# Altium project ebc_aux_power.PrjPcb
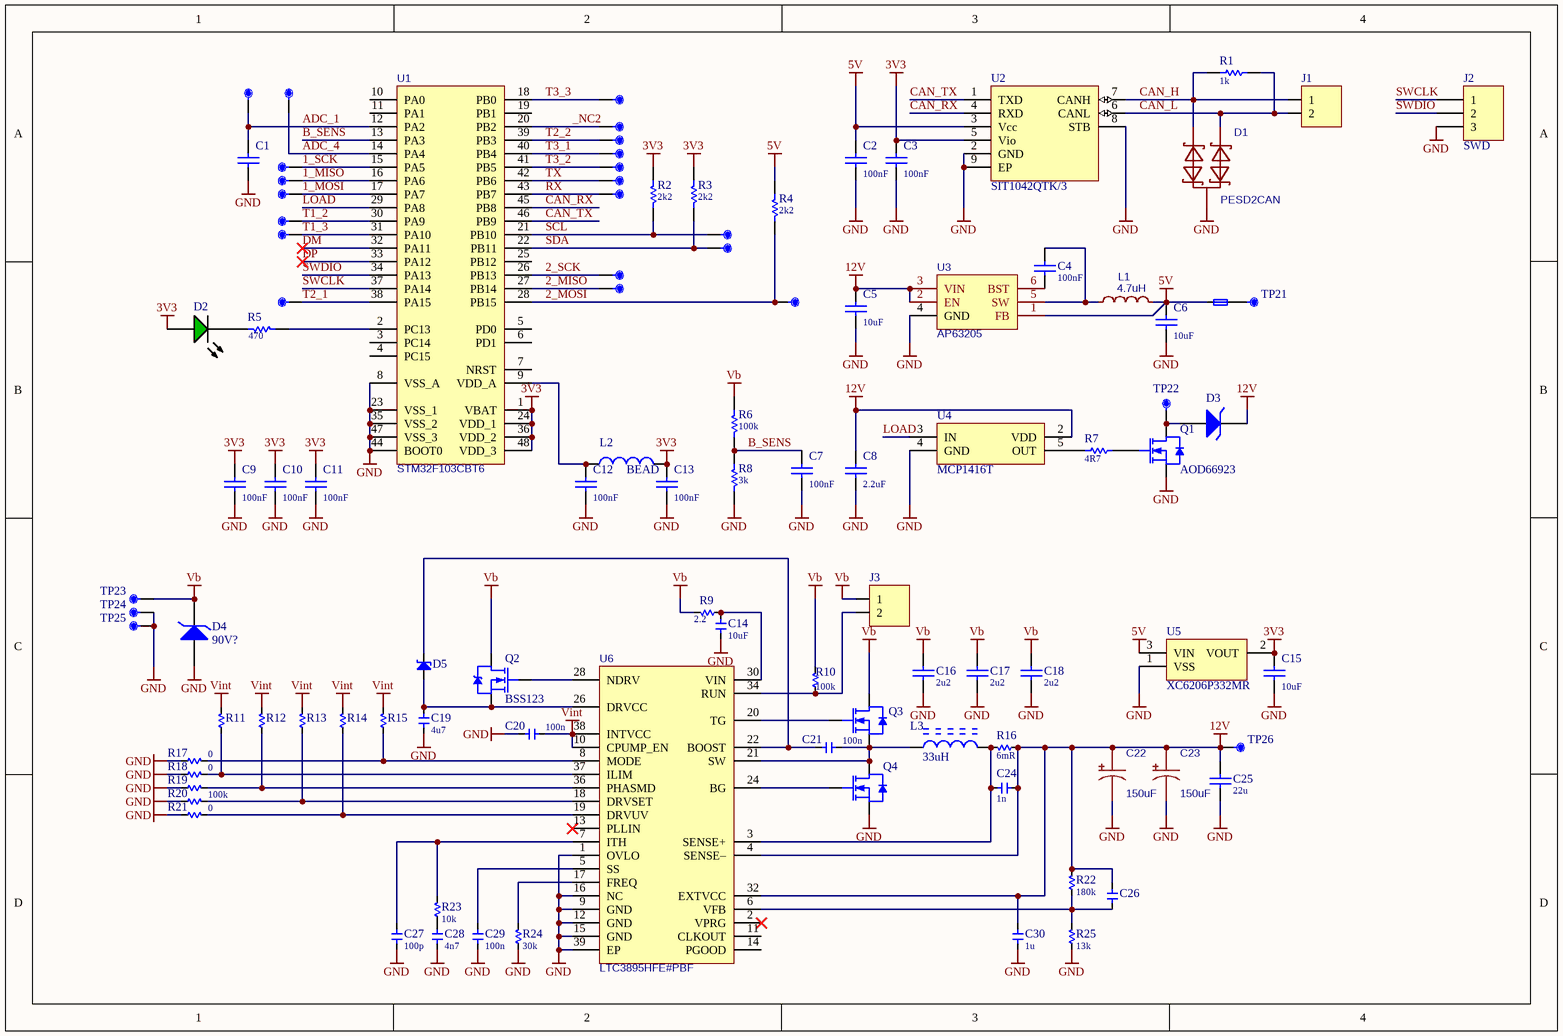
[diagram p0: schematic.SchDoc]
PRJ_ID: EBC Aux Power; PRJ_VER: 1.0.0
1 sheet, 103 parts. Net scope: global (net labels, ports and power ports of the same name join across sheets).
Board file: board.PcbDoc

## Sheet schematic.SchDoc
size A4

### Parts
C1  100nF  [C0402]  (value not drawn)
C2  100nF  [C0402]
C3  100nF  [C0402]
C4  100nF  [C0402]
C5  10uF  [C1206]
C6  10uF  [C1206]
C7  100nF  [C0402]
C8  2.2uF  [C0603]
C9  100nF  [C0402]
C10  100nF  [C0402]
C11  100nF  [C0402]
C12  100nF  [C0402]
C13  100nF  [C0402]
C14  10uF  [C0805]
C15  10uF  [C0603]
C16  2u2  [C1210]
C17  2u2  [C1210]
C18  2u2  [C1210]
C19  4u7  [C0805]
C20  100n  [C0603]
C21  100n  [C0603]
C22  150uF  [C7343]
C23  150uF  [C7343]
C24  1n  [C0402]
C25  22u  [C1210]
C26  (no value)  [C0402]  (no BOM)
C27  100p  [C0402]
C28  4n7  [C0402]
C29  100n  [C0402]
C30  1u  [C0805]
D1  PESD2CAN  [SOT-23]
D2  GRN  [LED-0603-GRN]  (value not drawn)
D3  (no value)  [SMC]
D4  90V?  [SMC]
D5  1N4148WS  [SOD-323]  (value not drawn)
F1  0.25A  [FUSE-1206]  (value not drawn)
J1  (no value)  [HDR-1X2_2.54]  (no BOM)
J2  SWD  [HDR-1x3-P1.25]  (no BOM)
J3  (no value)  [HDR-1x2-P1.25]  (no BOM)
L1  4.7uH  [IND-SMD_L4.4-W4.2]
L2  BEAD  [L0402]
L3  33uH  [IND_10X11.5MM]
Q1  AOD66923  [TO-252AA (DPAK)]
Q2  BSS123  [SOT-23]
Q3  AOD66923  [TO-252AA (DPAK)]  (value not drawn)
Q4  AOD66923  [TO-252AA (DPAK)]  (value not drawn)
R1  1k  [R1206]
R2  2k2  [R0402]
R3  2k2  [R0402]
R4  2k2  [R0402]
R5  470  [R0402]
R6  100k  [R0603]
R7  4R7  [R0402]
R8  3k  [R0603]
R9  2.2  [R0603]
R10  100k  [R0603]
R11  (no value)  [R0603]  (no BOM)
R12  (no value)  [R0603]  (no BOM)
R13  (no value)  [R0603]  (no BOM)
R14  (no value)  [R0603]  (no BOM)
R15  (no value)  [R0603]  (no BOM)
R16  6mR  [R2512-WIDE]
R17  0  [R0603]
R18  0  [R0603]
R19  (no value)  [R0603]  (no BOM)
R20  100k  [R0603]
R21  0  [R0603]
R22  180k  [R0603]
R23  10k  [R0603]
R24  30k  [R0603]
R25  13k  [R0603]
TP1  (no value)  [TP_THT]  (no BOM)
TP2  (no value)  [TP_THT]  (no BOM)
TP3  (no value)  [TP_THT]  (no BOM)
TP4  (no value)  [TP_THT]  (no BOM)
TP5  (no value)  [TP_THT]  (no BOM)
TP6  (no value)  [TP_THT]  (no BOM)
TP7  (no value)  [TP_THT]  (no BOM)
TP8  (no value)  [TP_THT]  (no BOM)
TP9  (no value)  [TP_THT]  (no BOM)
TP10  (no value)  [TP_THT]  (no BOM)
TP11  (no value)  [TP_THT]  (no BOM)
TP12  (no value)  [TP_THT]  (no BOM)
TP13  (no value)  [TP_THT]  (no BOM)
TP14  (no value)  [TP_THT]  (no BOM)
TP15  (no value)  [TP_THT]  (no BOM)
TP16  (no value)  [TP_THT]  (no BOM)
TP17  (no value)  [TP_THT]  (no BOM)
TP18  (no value)  [TP_THT]  (no BOM)
TP19  (no value)  [TP_THT]  (no BOM)
TP20  (no value)  [TP_THT]  (no BOM)
TP21  (no value)  [TP_THT]  (no BOM)
TP22  (no value)  [TP_THT]  (no BOM)
TP23  (no value)  [TP_THT]  (no BOM)
TP24  (no value)  [TP_THT]  (no BOM)
TP25  (no value)  [TP_THT]  (no BOM)
TP26  (no value)  [TP_THT]  (no BOM)
U1  STM32F103CBT6  [LQFP-48]
U2  SIT1042QTK/3  [DFN8_3X3_P065]
U3  AP63205  [SOT-23-6]
U4  MCP1416T  [SOT-23-5]
U5  XC6206P332MR  [SOT-23]
U6  LTC3895HFE#PBF  [TSSOP-38_L9.7-W4.4-P0.50-LS6.4-BL-EP-PE]

### Nets
3V3: C3.2 C9.2 C10.2 C11.2 C13.2 C15.2 D2.1(A) L2.1 R2.2 R3.2 U1.1(VBAT) U1.24(VDD_1) U1.36(VDD_2) U1.48(VDD_3) U2.5(Vio) U5.2(VOUT)
5V: C2.2 C6.2 F1.2 L1.2 R4.2 U2.3(Vcc) U3.1(FB) U5.3(VIN)
12V: C5.2 C8.2 C22.1 C23.1 C24.1 C25.2 C26.1 C30.1 D3.2(+) R16.2 R22.1 TP26.1 U3.2(EN) U3.3(VIN) U4.2(VDD) U6.4(SENSE–) U6.32(EXTVCC)
GND: C1.1 C2.1 C3.1 C5.1 C6.1 C7.1 C8.1 C9.1 C10.1 C11.1 C12.1 C13.1 C14.2 C15.1 C16.1 C17.1 C18.1 C19.2 C20.1 C22.2 C23.2 C25.1 C27.2 C28.2 C29.2 C30.2 D1.3 D4.1(-) J2.3 Q1.3(SOURCE) Q4.3(SOURCE) R8.1 R17.2 R18.2 R19.2 R20.2 R21.2 R24.2 R25.2 TP24.1 TP25.1 U1.8(VSS_A) U1.23(VSS_1) U1.35(VSS_2) U1.44(BOOT0) U1.47(VSS_3) U2.2(GND) U2.8(STB) U2.9(EP) U3.4(GND) U4.4(GND) U5.1(VSS) U6.1(OVLO) U6.9(GND) U6.12(GND) U6.15(GND) U6.16(NC) U6.39(EP)
Vb: C16.2 C17.2 C18.2 D4.2(+) J3.1 Q2.3(D) Q3.2(DRAIN) R6.2 R9.1 R10.1 TP23.1
Vint: C20.2 R11.1 R12.1 R13.1 R14.1 R15.1 U6.10(CPUMP_EN) U6.38(INTVCC)
1_MISO: TP9.1 U1.16(PA6)
1_MOSI: TP11.1 U1.17(PA7)
1_SCK: TP7.1 U1.15(PA5)
2_MISO: TP18.1 U1.27(PB14)
2_MOSI: R4.1 TP20.1 U1.28(PB15)
2_SCK: TP17.1 U1.26(PB13)
_NC2: TP4.1 U1.20(PB2)
ADC_1: C1.2 TP1.1 U1.12(PA2)
ADC_4: TP2.1 U1.14(PA4)
B_SENS: C7.2 R6.1 R8.2 U1.13(PA3)
CAN_H: D1.1 J1.1 R1.2 U2.7(CANH)
CAN_L: D1.2 J1.2 R1.1 U2.6(CANL)
CAN_RX: U1.45(PB8) U2.4(RXD)
CAN_TX: U1.46(PB9) U2.1(TXD)
DM: U1.32(PA11)
DP: U1.33(PA12)
LOAD: U1.29(PA8) U4.3(IN)
RX: TP12.1 U1.43(PB7)
SCL: R2.1 TP15.1 U1.21(PB10)
SDA: R3.1 TP16.1 U1.22(PB11)
SWCLK: J2.1 U1.37(PA14)
SWDIO: J2.2 U1.34(PA13)
T1_2: TP13.1 U1.30(PA9)
T1_3: TP14.1 U1.31(PA10)
T2_1: TP19.1 U1.38(PA15)
T2_2: TP5.1 U1.39(PB3)
T3_1: TP6.1 U1.40(PB4)
T3_2: TP8.1 U1.41(PB5)
T3_3: TP3.1 U1.18(PB0)
TX: TP10.1 U1.42(PB6)
NetC4_1: C4.1 U3.6(BST)
NetC4_2: C4.2 L1.1 U3.5(SW)
NetC12_2: C12.2 L2.2 U1.9(VDD_A)
NetC14_1: C14.1 R9.2 U6.30(VIN)
NetC19_1: C19.1 D5.1(-) Q2.2(S) U6.26(DRVCC)
NetC21_1: C21.1 L3.1 Q3.3(SOURCE) Q4.2(DRAIN) U6.21(SW)
NetC21_2: C21.2 D5.2(+) U6.22(BOOST)
NetC24_2: C24.2 L3.2 R16.1 U6.3(SENSE+)
NetC26_2: C26.2 R22.2 R25.1 U6.6(VFB)
NetC27_1: C27.1 R23.1 U6.7(ITH)
NetC28_1: C28.1 R23.2
NetC29_1: C29.1 U6.5(SS)
NetD2_2: D2.2(K) R5.1
NetD3_1: D3.1(-) Q1.2(DRAIN) TP22.1
NetF1_1: F1.1 TP21.1
NetJ3_2: J3.2 R10.2 U6.34(RUN)
NetQ1_1: Q1.1(GATE) R7.2
NetQ2_1: Q2.1(G) U6.28(NDRV)
NetQ3_1: Q3.1(GATE) U6.20(TG)
NetQ4_1: Q4.1(GATE) U6.24(BG)
NetR5_2: R5.2 U1.2(PC13)
NetR7_1: R7.1 U4.5(OUT)
NetR11_2: R11.2 R18.1 U6.37(ILIM)
NetR12_2: R12.2 R19.1 U6.36(PHASMD)
NetR13_2: R13.2 R20.1 U6.18(DRVSET)
NetR14_2: R14.2 R21.1 U6.19(DRVUV)
NetR15_2: R15.2 R17.1 U6.8(MODE)
NetR24_1: R24.1 U6.17(FREQ)

Not connected (* = marked no-connect by the designer): U1 3(PC14) 4(PC15) 5(PD0) 6(PD1) 7(NRST) 10(PA0) 11(PA1) 19(PB1) 25(PB12); U6 2(VPRG)* 11(CLKOUT) 13(PLLIN)* 14(PGOOD)

### Notes on the sheet
- Title
- Size:
- Date:
- File:
- A2
- Number:
- Time:
- Revision:
- Sheet
- of

### Library data of the parts
C1 C4 C7 C9-C13 C15-C18 = CAP
C2 C3 = CAP: P/N: CC0402KRX7R9BB104; LCSC part number: C131394
C5 C6 C14 C19-C21 C24 C26-C30 = CAP: P/N: CL31B106KBHNNNE; LCSC part number: C89632
C8 = CAP: P/N: GRM188Z71E225KE43D; LCSC part number: C415535
C22 C23 = 220uF
C25 = CAP: P/N: GMK325BJ226MM-P; LCSC part number: C778721
D1 = CDSOT23-SM712: LCSC part number: C5261081; P/N: PESD2CAN
D2 = LED-0603-GREEN: LED 0603 GRN
D3-D5 = NCP51460SN33T1G: P/N: SMCJ24A; LCSC part number: C693617
F1 = Fuse 1: P/N: TLC-LSMD075/60; LCSC part number: C2924950
J1 J3 = Header 2
J2 = Header 3
L1 = 4.7uH: P/N: FXL0420-4R7-M; LCSC part number: C167208
L2 = BLM18AG601SN1D: BEAD 0402
L3 = SRN3015-100M: FXL1050-330-M
Q1 Q3 Q4 = 2N7002
Q2 = IRLML2402: HEXFET Power MOSFET
R1-R6 R8-R25 = RES
R7 = RES: P/N: RC0402JR-074R7L; LCSC part number: C137862
TP1-TP26 = TP_Dup1
U2 = LTC2875: IC INTERFACE CAN; LCSC part number: C5308062; P/N: SIT1042QTK/3
U3 = AP63203WU-7: LCSC part number: C780769; P/N: AP63203WU-7
U4 = FL3100T: IC GATE DRVR LOW-SIDE SOT23; P/N: MCP1416T-E/OT; LCSC part number: C83775
U5 = Component_4_1
U6 = LTC3895HFE#PBF: LCSC part number: C580817; P/N: LTC3895HFE#PBF